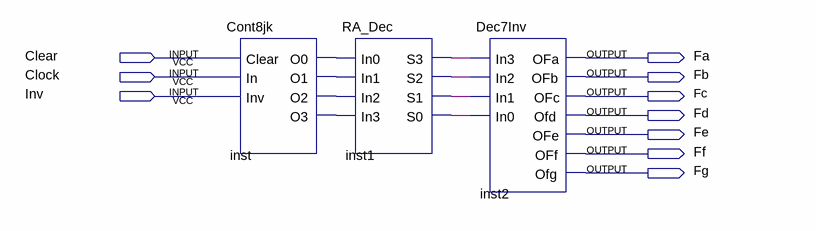
[diagram p0: schematic sheet]
// Quartus schematic Lab4.bdf as structural Verilog: 3 symbols, 10 pins
module Lab4 (
  input  Clear,
  input  Clock,
  input  Inv,
  output Fa,
  output Fb,
  output Fc,
  output Fd,
  output Fe,
  output Ff,
  output Fg
);

  wire inst1_s0, inst1_s1, inst1_s2, inst1_s3, inst_o0, inst_o1, inst_o2, inst_o3;

  Cont8jk inst (.Clear(Clear), .In(Clock), .Inv(Inv), .O0(inst_o0), .O1(inst_o1), .O2(inst_o2), .O3(inst_o3));
  RA_Dec inst1 (
    .In0(inst_o0), .In1(inst_o1), .In2(inst_o2), .In3(inst_o3), .S3(inst1_s3), .S2(inst1_s2), .S1(inst1_s1),
    .S0(inst1_s0));
  Dec7Inv inst2 (
    .In3(inst1_s3), .In2(inst1_s2), .In1(inst1_s1), .In0(inst1_s0), .OFa(Fa), .OFb(Fb), .OFc(Fc), .Ofd(Fd),
    .OFe(Fe), .OFf(Ff), .Ofg(Fg));
endmodule
